# EAGLE schematic SmoothieBrainz - next round (EAGLE 8.4.3)
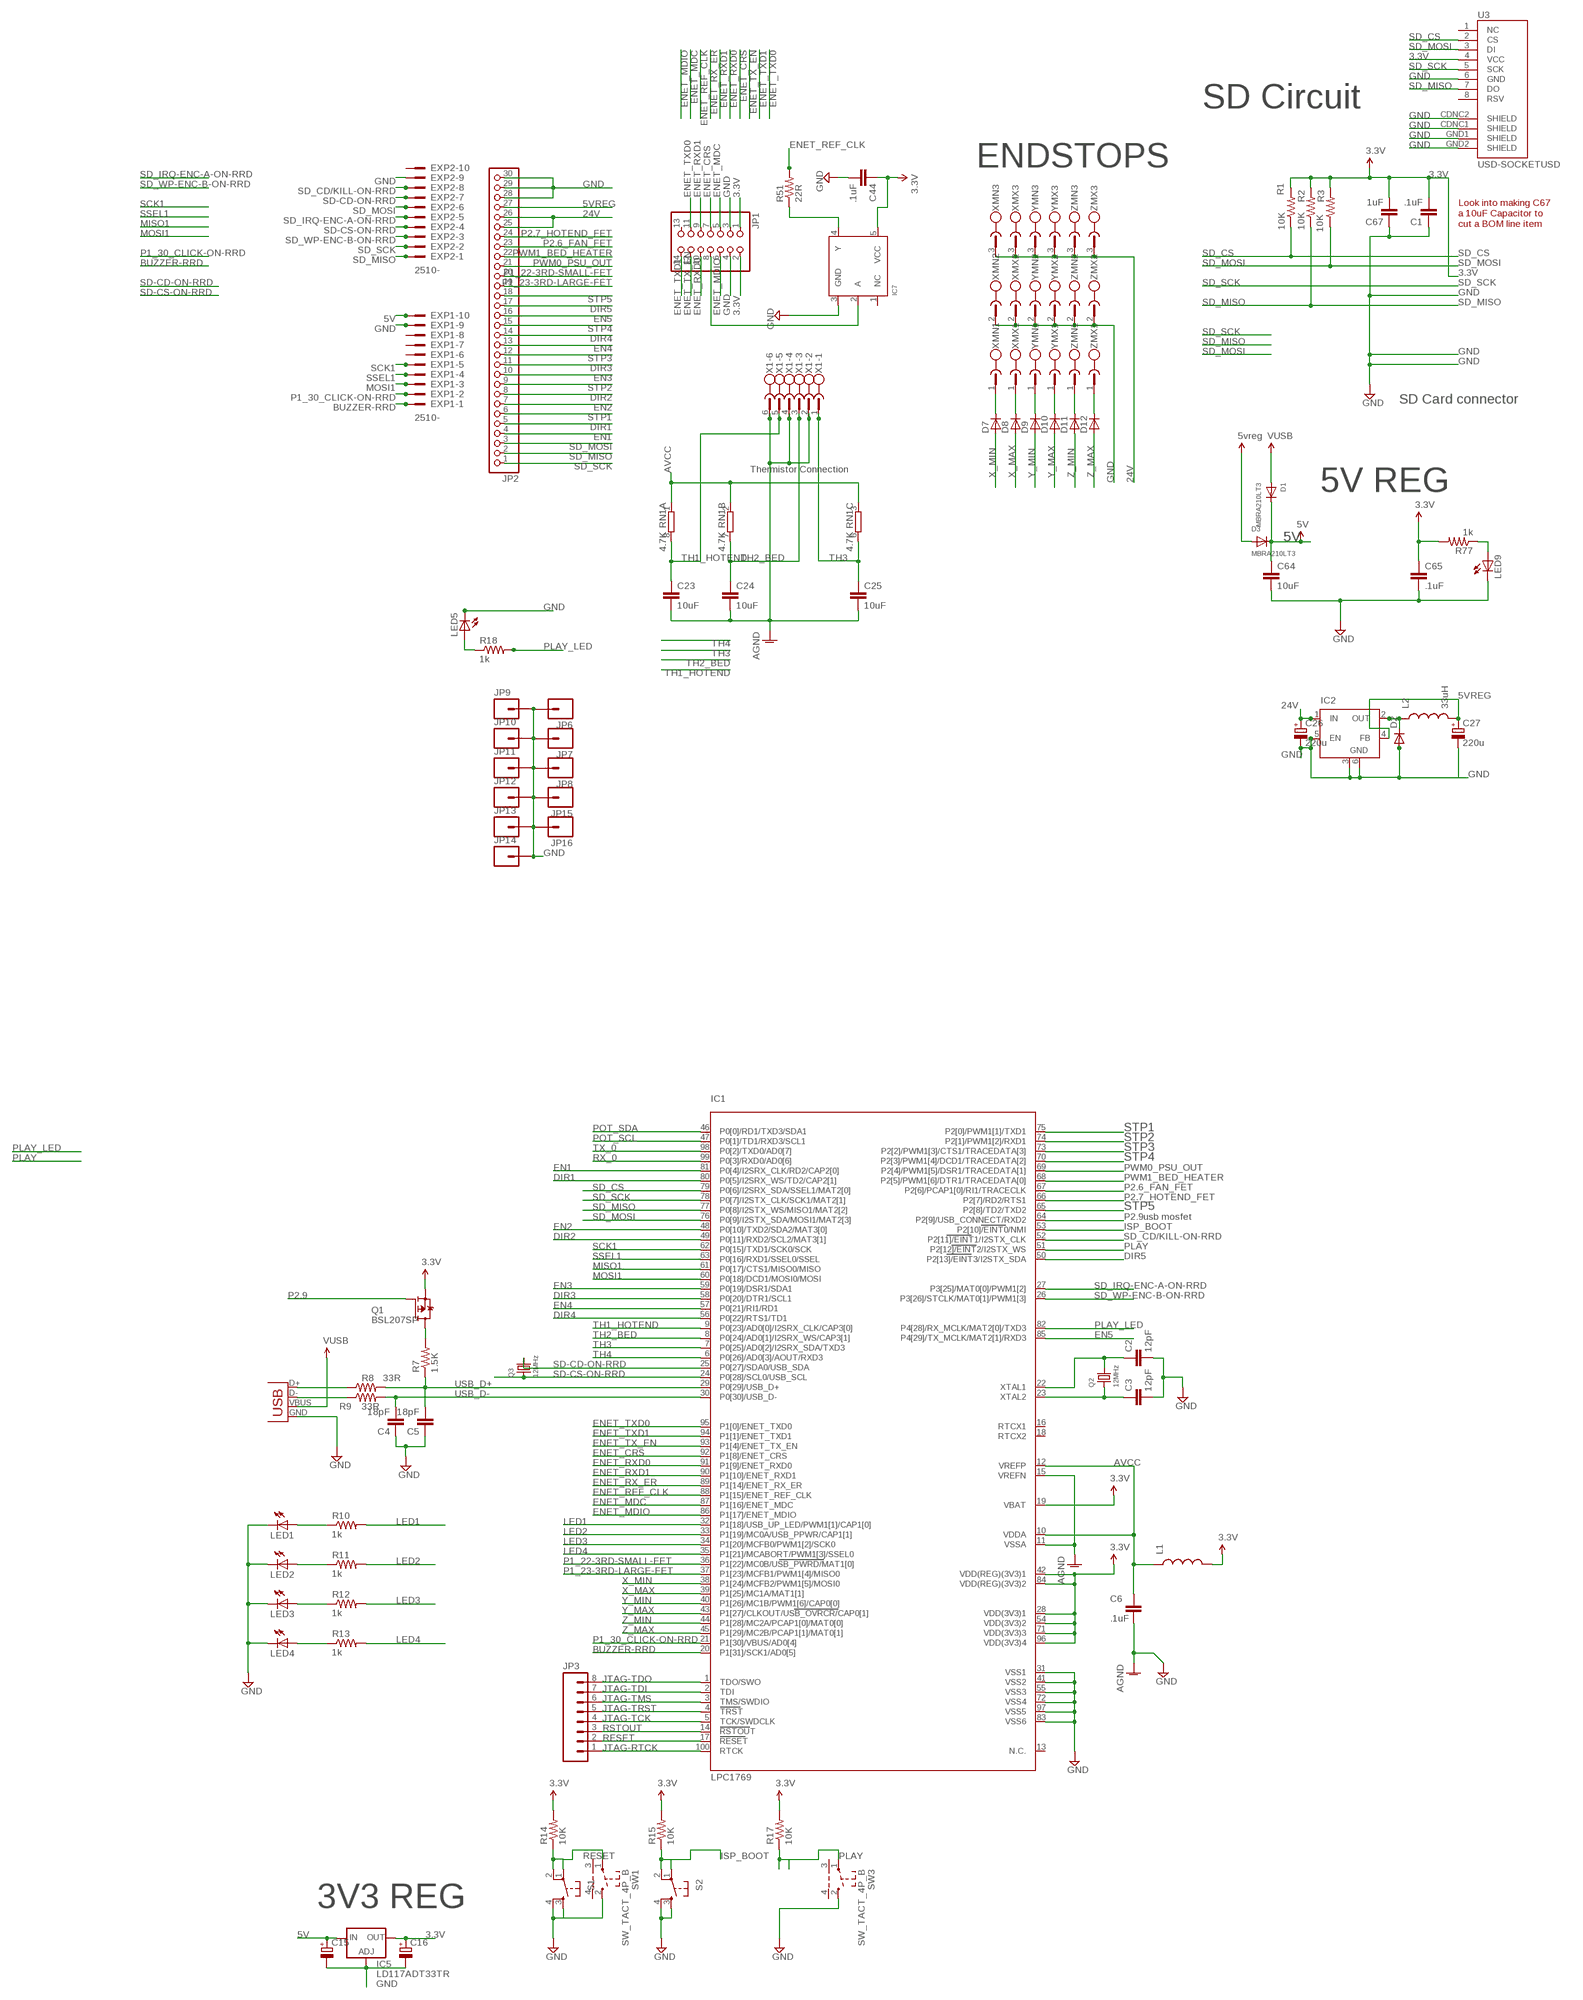
[diagram p0: schematic, sheet 1, part 1 of 2]
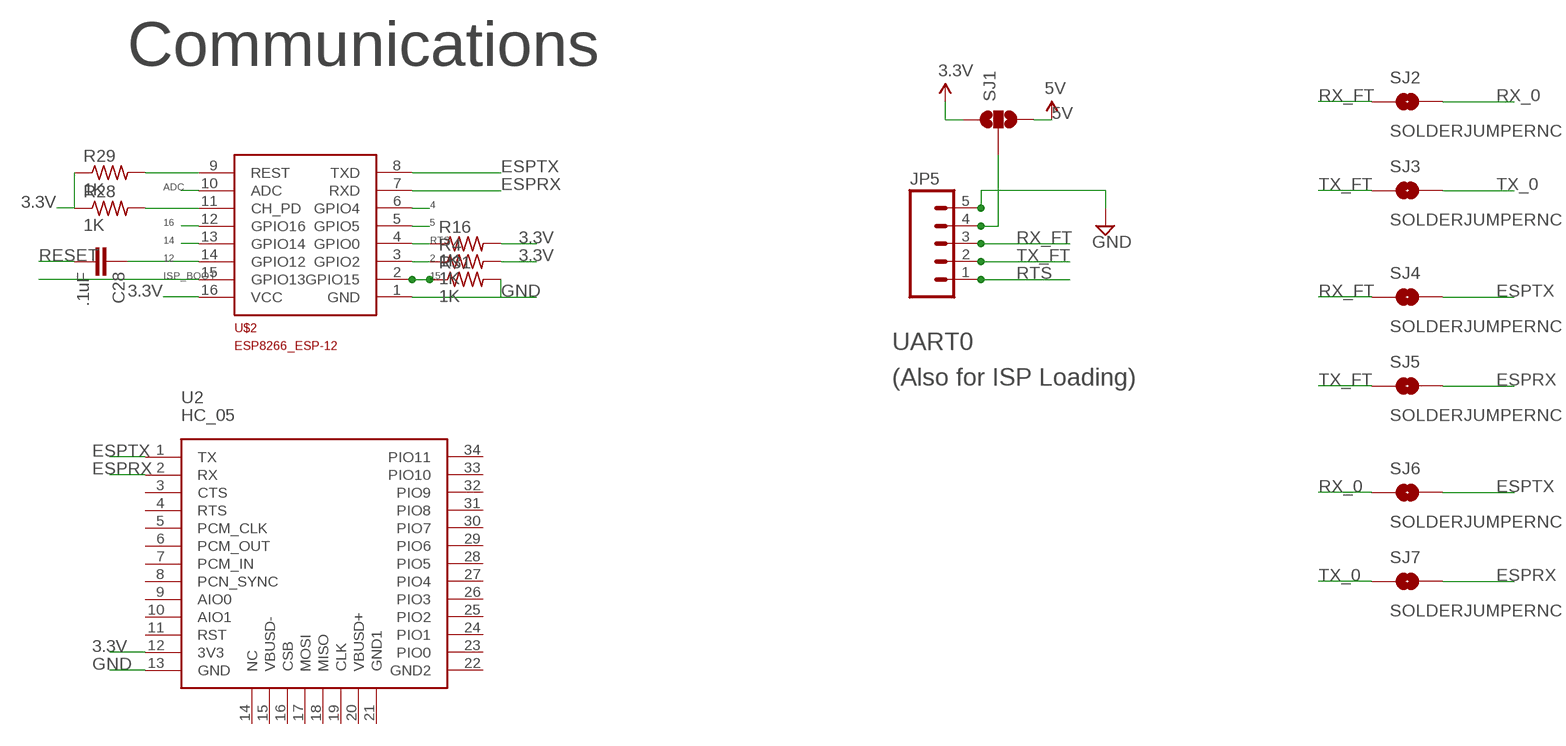
[diagram p1: schematic, sheet 1, part 2 of 2]

## Parts
C1  .1uF  C-EUC0603  [C0603]
C2  12pF  C-EUC0603  [C0603@1]
C3  12pF  C-EUC0603  [C0603@1]
C4  18pF  C-EUC0603  [C0603@1]
C5  18pF  C-EUC0603  [C0603@1]
C6  .1uF  C-EUC0603  [C0603@1]
C15  CPOL-EUE2.5-7  [E2,5-7]
C16  CPOL-EUE2.5-7  [E2,5-7]
C23  10uF  C-EUC0603  [C0603]
C24  10uF  C-EUC0603  [C0603]
C25  10uF  C-EUC0603  [C0603]
C26  220u  CPOL-EUE2.5-7  [E2,5-7]
C27  220u  CPOL-EUE2.5-7  [E2,5-7]
C28  .1uF  C-EUC0603  [C0603]
C44  .1uF  C-EUC0603  [C0603]
C64  10uF  C-EUC0603  [C0603]
C65  .1uF  C-EUC0603  [C0603]
C67  1uF  C-EUC0603  [C0603]
D1  MBRA210LT3  DIODESMA  [SMADIODE]
D2  DIODE-DO-214AC  [DO-214AC]
D3  MBRA210LT3  DIODESMA  [SMADIODE]
D7  D-SOD-87  [SOD87]
D8  D-SOD-87  [SOD87]
D9  D-SOD-87  [SOD87]
D10  D-SOD-87  [SOD87]
D11  D-SOD-87  [SOD87]
D12  D-SOD-87  [SOD87]
EXP1  2510-  [PAK100/2500-10]
EXP2  2510-  [PAK100/2500-10]
IC1  LPC1769  LPC1768  [LQFP100]
IC2  LM2596S  [TO263-5]
IC5  LD117ADT33TR  [DPACK]
IC7  74LVC1G04  [SOT23-5]
JP1  PINHD-2X7/90  [2X07/90]
JP2  PINHD-1X30  [1X30]
JP3  M08NO_SILK_FEMALE_PTH  [1X08_NO_SILK]
JP5  M05NO_SILK  [1X05_NO_SILK]
JP6  M01NOSILK-KIT  [1X01NS-KIT]
JP7  M01NOSILK-KIT  [1X01NS-KIT]
JP8  M01NOSILK-KIT  [1X01NS-KIT]
JP9  M01NOSILK-KIT  [1X01NS-KIT]
JP10  M01NOSILK-KIT  [1X01NS-KIT]
JP11  M01NOSILK-KIT  [1X01NS-KIT]
JP12  M01NOSILK-KIT  [1X01NS-KIT]
JP13  M01NOSILK-KIT  [1X01NS-KIT]
JP14  M01NOSILK-KIT  [1X01NS-KIT]
JP15  M01NOSILK-KIT  [1X01NS-KIT]
JP16  M01NOSILK-KIT  [1X01NS-KIT]
L1  INDUCTOR0603  [0603]
L2  33uH  INDUCTORPWR  [CDRH125]
LED1  LEDCHIP-LED0805  [CHIP-LED0805]
LED2  LEDCHIP-LED0805  [CHIP-LED0805]
LED3  LEDCHIP-LED0805  [CHIP-LED0805]
LED4  LEDCHIP-LED0805  [CHIP-LED0805]
LED5  LEDCHIP-LED0805  [CHIP-LED0805]
LED9  LEDCHIP-LED0805  [CHIP-LED0805]
Q1  BSL207SP  [SC74_INFINEON]
Q2  12MHz  CRYSTALTHIN  [CRYSTAL_3.2X2.5]
Q3  12MHz  CRYSTALTHIN  [CRYSTAL_3.2X2.5]
R1  10K  R-US_R0603  [R0603]
R2  10K  R-US_R0603  [R0603]
R3  10K  R-US_R0603  [R0603]
R4  1K  R-US_R0603  [R0603]
R7  1.5K  R-US_R0603  [R0603]
R8  33R  R-US_R0603  [R0603]
R9  33R  R-US_R0603  [R0603]
R10  1k  R-US_R0603  [R0603]
R11  1k  R-US_R0603  [R0603]
R12  1k  R-US_R0603  [R0603]
R13  1k  R-US_R0603  [R0603]
R14  10K  R-US_R0603  [R0603]
R15  10K  R-US_R0603  [R0603]
R16  1K  R-US_R0603  [R0603]
R17  10K  R-US_R0603  [R0603]
R18  1k  R-US_R0603  [R0603]
R28  1K  R-US_R0603  [R0603]
R29  1K  R-US_R0603  [R0603]
R31  1K  R-US_R0603  [R0603]
R51  22R  R-US_R0603  [R0603]
R77  1k  R-US_R0603  [R0603]
RN1  4.7K  4R-N0603-ARV  [0603-ARV]
S1  TAC_SWITCHSMD  [TACTILE_SWITCH_SMD]
S2  TAC_SWITCHSMD  [TACTILE_SWITCH_SMD]
SJ1  SOLDERJUMPER_2WAYS  [SJ_3]
SJ2  SOLDERJUMPERNC  [SJ_2S]
SJ3  SOLDERJUMPERNC  [SJ_2S]
SJ4  SOLDERJUMPERNC  [SJ_2S]
SJ5  SOLDERJUMPERNC  [SJ_2S]
SJ6  SOLDERJUMPERNC  [SJ_2S]
SJ7  SOLDERJUMPERNC  [SJ_2S]
SW1  SW_TACT_4P_B  [SW_TACT_STANDARD_RIGHT_ANGLE]
SW3  SW_TACT_4P_B  [SW_TACT_STANDARD_RIGHT_ANGLE]
U2  HC_05  [BLUETOOTH_SMD]
U3  USD-SOCKETUSD  [USD-SOCKET-PP]
U$2  ESP8266_ESP-12  [ESP8266-ESP12]
X1  MC1.5/6  [MC1.5/6-G-3.81]
X14  USBPTH  [USB-B-PTH]
XMN  MC1.5/3  [MC1.5/3-G-3.81]
XMX  MC1.5/3  [MC1.5/3-G-3.81]
YMN  MC1.5/3  [MC1.5/3-G-3.81]
YMX  MC1.5/3  [MC1.5/3-G-3.81]
ZMN  MC1.5/3  [MC1.5/3-G-3.81]
ZMX  MC1.5/3  [MC1.5/3-G-3.81]

## Nets
2: R4.1 U$2.3(GPIO2)
3.3V: C1.2 C16.+ C44.1 C65.1 C67.2 IC1.19(VBAT) IC1.28(VDD(3V3)1) IC1.42(VDD(REG)(3V3)1) IC1.54(VDD(3V3)2) IC1.71(VDD(3V3)3) IC1.84(VDD(REG)(3V3)2) IC1.96(VDD(3V3)4) IC5.4(OUT) IC7.5(VCC) JP1.1 JP1.2 L1.2 Q1.4(S) R1.2 R2.2 R3.2 R4.2 R14.2 R15.2 R16.2 R17.2 R28.1 R29.1 R77.2 SJ1.1 U2.12(3V3) U3.4(VCC) U$2.16(VCC)
4: U$2.6(GPIO4)
5: U$2.5(GPIO5)
5V: C15.+ C64.1 D1.C D3.C EXP1.10 IC5.3(IN) SJ1.3
5VREG: C27.+ D3.A IC2.4(FB) JP2.27 L2.2 ; supply symbol labelled 5vreg
12: C28.1 U$2.14(GPIO12)
14: U$2.13(GPIO14)
15: R31.1 U$2.2(GPIO15)
16: U$2.12(GPIO16)
24V: C26.+ IC2.1(IN) JP2.25 JP2.26 XMN.3 XMX.3 YMN.3 YMX.3 ZMN.3 ZMX.3
ADC: U$2.10(ADC)
AGND: C6.2 C23.2 C24.2 C25.2 IC1.11(VSSA) IC1.15(VREFN) X1.2 X1.4 X1.6 ; supply symbol labelled GND
AVCC: C6.1 IC1.10(VDDA) IC1.12(VREFP) L1.1 RN1.1 RN1.2 RN1.3
BUZZER-RRD: EXP1.1 IC1.20(P1[31]/SCK1/AD0[5])
DIR1: IC1.80(P0[5]/I2SRX_WS/TD2/CAP2[1]) JP2.5
DIR2: IC1.49(P0[11]/RXD2/SCL2/MAT3[1]) JP2.8
DIR3: IC1.58(P0[20]/DTR1/SCL1) JP2.11
DIR4: IC1.56(P0[22]/RTS1/TD1) JP2.14
DIR5: IC1.50(P2[13]/EINT3/I2STX_SDA) JP2.17
EN1: IC1.81(P0[4]/I2SRX_CLK/RD2/CAP2[0]) JP2.4
EN2: IC1.48(P0[10]/TXD2/SDA2/MAT3[0]) JP2.7
EN3: IC1.59(P0[19]/DSR1/SDA1) JP2.10
EN4: IC1.57(P0[21]/RI1/RD1) JP2.13
EN5: IC1.85(P4[29]/TX_MCLK/MAT2[1]/RXD3) JP2.16
ENET_CRS: IC1.92(P1[8]/ENET_CRS) JP1.7
ENET_MDC: IC1.87(P1[16]/ENET_MDC) JP1.5
ENET_MDIO: IC1.86(P1[17]/ENET_MDIO) JP1.6
ENET_REF_CLK: IC1.88(P1[15]/ENET_REF_CLK) R51.2
ENET_RX_ER: IC1.89(P1[14]/ENET_RX_ER)
ENET_RXD0: IC1.91(P1[9]/ENET_RXD0) JP1.10
ENET_RXD1: IC1.90(P1[10]/ENET_RXD1) JP1.9
ENET_TX_EN: IC1.93(P1[4]/ENET_TX_EN) JP1.12
ENET_TXD0: IC1.95(P1[0]/ENET_TXD0) JP1.11
ENET_TXD1: IC1.94(P1[1]/ENET_TXD1) JP1.14
ESPRX: SJ5.2 SJ7.2 U2.2(RX) U$2.7(RXD)
ESPTX: SJ4.2 SJ6.2 U2.1(TX) U$2.8(TXD)
GND: C1.1 C2.2 C3.2 C4.1 C5.1 C15.- C16.- C26.- C27.- C44.2 C64.2 C65.2 C67.1 D2.2(A) EXP1.9 EXP2.9 IC1.31(VSS1) IC1.41(VSS2) IC1.55(VSS3) IC1.72(VSS4) IC1.83(VSS6) IC1.97(VSS5) IC2.3(GND) IC2.5(EN) IC2.6(GND) IC5.1(ADJ) IC7.3(GND) JP1.3 JP1.4 JP2.28 JP2.29 JP2.30 JP5.5 JP6.1 JP7.1 JP8.1 JP9.1 JP10.1 JP11.1 JP12.1 JP13.1 JP14.1 JP15.1 JP16.1 LED1.C LED2.C LED3.C LED4.C LED5.C LED9.C R31.2 S1.3 S1.4 S2.3 S2.4 SW1.2 SW3.2 U2.13(GND) U3.6(GND) U3.CDNC1(SHIELD) U3.CDNC2(SHIELD) U3.GND1(SHIELD) U3.GND2(SHIELD) U$2.1(GND) X14.GND XMN.2 XMX.2 YMN.2 YMX.2 ZMN.2 ZMX.2
ISP_BOOT: IC1.53(P2[10]/EINT0/NMI) R15.1 S2.1 S2.2 U$2.15(GPIO13)
JTAG-RTCK: IC1.100(RTCK) JP3.1
JTAG-TCK: IC1.5(TCK/SWDCLK) JP3.4
JTAG-TDI: IC1.2(TDI) JP3.7
JTAG-TDO: IC1.1(TDO/SWO) JP3.8
JTAG-TMS: IC1.3(TMS/SWDIO) JP3.6
JTAG-TRST: IC1.4(TRST) JP3.5
LED1: IC1.32(P1[18]/USB_UP_LED/PWM1[1]/CAP1[0]) R10.2
LED2: IC1.33(P1[19]/MC0A/USB_PPWR/CAP1[1]) R11.2
LED3: IC1.34(P1[20]/MCFB0/PWM1[2]/SCK0) R12.2
LED4: IC1.35(P1[21]/MCABORT/PWM1[3]/SSEL0) R13.2
MISO1: IC1.61(P0[17]/CTS1/MISO0/MISO)
MOSI1: EXP1.3 IC1.60(P0[18]/DCD1/MOSI0/MOSI)
N$1: C2.1 IC1.22(XTAL1) Q2.2
N$2: C3.1 IC1.23(XTAL2) Q2.1
N$3: LED5.A R18.1
N$6: D7.1(C) XMN.1
N$8: D8.1(C) XMX.1
N$9: D2.1(C) IC2.2(OUT) L2.1
N$10: D9.1(C) YMN.1
N$12: D10.1(C) YMX.1
N$15: D11.1(C) ZMN.1
N$16: D12.1(C) ZMX.1
N$18: R28.2 U$2.11(CH_PD)
N$23: JP5.4 SJ1.2
N$51: Q1.1(D) Q1.2(D) Q1.5(D) Q1.6(D) R7.2
N$61: R8.1 X14.D+
N$62: R9.1 X14.D-
N$77: IC7.2(A) JP1.8
N$78: IC7.4(Y) R51.1
N$80: LED9.A R77.1
N$84: LED4.A R13.1
N$85: LED3.A R12.1
N$86: LED2.A R11.1
N$87: LED1.A R10.1
P1_22-3RD-SMALL-FET: IC1.36(P1[22]/MC0B/USB_PWRD/MAT1[0]) JP2.20
P1_23-3RD-LARGE-FET: IC1.37(P1[23]/MCFB1/PWM1[4]/MISO0) JP2.19
P1_30_CLICK-ON-RRD: EXP1.2 IC1.21(P1[30]/VBUS/AD0[4])
P2.6_FAN_FET: IC1.67(P2[6]/PCAP1[0]/RI1/TRACECLK) JP2.23
P2.7_HOTEND_FET: IC1.66(P2[7]/RD2/RTS1) JP2.24
P2.9: IC1.64(P2[9]/USB_CONNECT/RXD2) Q1.3(G)
PLAY: IC1.51(P2[12]/EINT2/I2STX_WS) R17.1 SW3.1
PLAY_LED: IC1.82(P4[28]/RX_MCLK/MAT2[0]/TXD3) R18.2
POT_SCL: IC1.47(P0[1]/TD1/RXD3/SCL1)
POT_SDA: IC1.46(P0[0]/RD1/TXD3/SDA1)
PWM0_PSU_OUT: IC1.69(P2[4]/PWM1[5]/DSR1/TRACEDATA[1]) JP2.21
PWM1_BED_HEATER: IC1.68(P2[5]/PWM1[6]/DTR1/TRACEDATA[0]) JP2.22
RESET: C28.2 IC1.17(RESET) JP3.2 R14.1 S1.1 S1.2 SW1.1
RESET1: R29.2 U$2.9(REST)
RSTOUT: IC1.14(RSTOUT) JP3.3
RTS: JP5.1 R16.1 U$2.4(GPIO0)
RX_0: IC1.99(P0[3]/RXD0/AD0[6]) SJ2.2 SJ6.1
RX_FT: JP5.3 SJ2.1 SJ4.1
SCK1: EXP1.5 IC1.62(P0[15]/TXD1/SCK0/SCK)
SD-CD-ON-RRD: EXP2.7 IC1.25(P0[27]/SDA0/USB_SDA) Q3.2
SD-CS-ON-RRD: EXP2.4 IC1.24(P0[28]/SCL0/USB_SCL) Q3.1
SD_CD/KILL-ON-RRD: EXP2.8 IC1.52(P2[11]/EINT1/I2STX_CLK)
SD_CS: IC1.79(P0[6]/I2SRX_SDA/SSEL1/MAT2[0]) R1.1 U3.2(CS)
SD_IRQ-ENC-A-ON-RRD: EXP2.5 IC1.27(P3[25]/MAT0[0]/PWM1[2])
SD_MISO: EXP2.1 IC1.77(P0[8]/I2STX_WS/MISO1/MAT2[2]) JP2.2 R2.1 U3.7(DO)
SD_MOSI: EXP2.6 IC1.76(P0[9]/I2STX_SDA/MOSI1/MAT2[3]) JP2.3 R3.1 U3.3(DI)
SD_SCK: EXP2.2 IC1.78(P0[7]/I2STX_CLK/SCK1/MAT2[1]) JP2.1 U3.5(SCK)
SD_WP-ENC-B-ON-RRD: EXP2.3 IC1.26(P3[26]/STCLK/MAT0[1]/PWM1[3])
SSEL1: EXP1.4 IC1.63(P0[16]/RXD1/SSEL0/SSEL)
STP1: IC1.75(P2[0]/PWM1[1]/TXD1) JP2.6
STP2: IC1.74(P2[1]/PWM1[2]/RXD1) JP2.9
STP3: IC1.73(P2[2]/PWM1[3]/CTS1/TRACEDATA[3]) JP2.12
STP4: IC1.70(P2[3]/PWM1[4]/DCD1/TRACEDATA[2]) JP2.15
STP5: IC1.65(P2[8]/TD2/TXD2) JP2.18
TH1_HOTEND: C23.1 IC1.9(P0[23]/AD0[0]/I2SRX_CLK/CAP3[0]) RN1.8 X1.5
TH2_BED: C24.1 IC1.8(P0[24]/AD0[1]/I2SRX_WS/CAP3[1]) RN1.7 X1.3
TH3: C25.1 IC1.7(P0[25]/AD0[2]/I2SRX_SDA/TXD3) RN1.6 X1.1
TH4: IC1.6(P0[26]/AD0[3]/AOUT/RXD3)
TX_0: IC1.98(P0[2]/TXD0/AD0[7]) SJ3.2 SJ7.1
TX_FT: JP5.2 SJ3.1 SJ5.1
USB_D+: C5.2 IC1.29(P0[29]/USB_D+) R7.1 R8.2
USB_D-: C4.2 IC1.30(P0[30]/USB_D-) R9.2
VUSB: D1.A X14.VBUS
X_MAX: D8.2(A) IC1.39(P1[25]/MC1A/MAT1[1])
X_MIN: D7.2(A) IC1.38(P1[24]/MCFB2/PWM1[5]/MOSI0)
Y_MAX: D10.2(A) IC1.43(P1[27]/CLKOUT/USB_OVRCR/CAP0[1])
Y_MIN: D9.2(A) IC1.40(P1[26]/MC1B/PWM1[6]/CAP0[0])
Z_MAX: D12.2(A) IC1.45(P1[29]/MC2B/PCAP1[1]/MAT0[1])
Z_MIN: D11.2(A) IC1.44(P1[28]/MC2A/PCAP1[0]/MAT0[0])
Unconnected: EXP1.6 EXP1.7 EXP1.8 EXP2.10 IC1.13(N.C.) IC1.16(RTCX1) IC1.18(RTCX2) IC7.1(NC) JP1.13 RN1.4 RN1.5 SW1.3 SW1.4 SW3.3 SW3.4 U2.3(CTS) U2.4(RTS) U2.5(PCM_CLK) U2.6(PCM_OUT) U2.7(PCM_IN) U2.8(PCN_SYNC) U2.9(AIO0) U2.10(AIO1) U2.11(RST) U2.14(NC) U2.15(VBUSD-) U2.16(CSB) U2.17(MOSI) U2.18(MISO) U2.19(CLK) U2.20(VBUSD+) U2.21(GND1) U2.22(GND2) U2.23(PIO0) U2.24(PIO1) U2.25(PIO2) U2.26(PIO3) U2.27(PIO4) U2.28(PIO5) U2.29(PIO6) U2.30(PIO7) U2.31(PIO8) U2.32(PIO9) U2.33(PIO10) U2.34(PIO11) U3.1(NC) U3.8(RSV)

## Notes on the sheet
- SD Circuit | Communications
- ENDSTOPS
- Look into making C67 
  a 10uF Capacitor to 
  cut a BOM line item
- UART0
- (Also for ISP Loading)
- SD Card connector
- Thermistor Connection
- 5V REG
- usb mosfet
- 3V3 REG

## Library data of the parts
C1 C23-C25 C28 C44 C64 C65 C67 = resistor:C-EU: CAPACITOR, European symbol
C2-C6 = rcl:C-EU: CAPACITOR, European symbol
C15 C16 C26 C27 = rcl:CPOL-EU: POLARIZED CAPACITOR, European symbol
D1 D3 = microbuilder:DIODE: Diode SMADIODE - SMA Surface Mount Package 20V 1A Schottky Diode Digikey (500mV @ 1A, 500uA Vr @ 20V): 641-1014-6-ND 10V 2A Schottky Diode Digikey (350mV @ 2A, 700uA Vr @ 10V): MBRA210LT3 SOD-123 30V 200mA (800mV Vf, 2uA Vr @ 25V) Schottky Diode (very fast switching for boost, etc.) - Digikey: BAT54T1GOSTR-ND 30V 500mA (430mV Vf, 130uA Vr @ 30V) Schottky Diode - Digikey: B0530W-FDICT-ND MBR120 1A 20V (0.34Vf) Schottky Diode - Digikey: MBR120VLSFT1GOSCT-ND SOD-323 10V 570mA (380mV Vf, 3ns) Schottky Diode - Digikey: ZLLS410CT-ND 1N4148WS - 75V 150mA (1V Vf @ 10mA, 4ns) Simple Diode - Digikey: 1N4148WSFSCT-ND, Mouser: 512-1N4148WS SOD-523 BAT54 30V 200mA Schottky (0.8 Vf @ 100mA, 5ns) - Digikey: BAT54XV2CT-ND 30V 30mA Schottky Diode (RB751S-40TE61) - Digikey: RB751S-40TE61CT-ND SOT23-R/W - SOT23 Package (R = Solder Paste/Reflow Ovens, W = Hand-Soldering) BAT54Film 40V 300mA - Digikey: 497-7162-1-ND DO-1N4148 Through Hole Small Current Diode (any model)
D2 = dp_devices:DIODE: Various Diode Packages
D7-D12 = semicon-smd-ipc:D-: DIODE unfilled
EXP1 EXP2 = con-3m:2510-: 3M (TM) Pak 100 4-Wall Header Source: 3M; MF: 3M; MPN: 2510-6002UB; OC_FARNELL: 9838244; OC_NEWARK: 46F4725
IC1 = microbuilder:LPC1768: LPC1768 100 MHz 32-bit ARM Cortex-M3 based microcontroller featuring a high level of integration and low power consumption. 512 kB Flash, 64 kB SRAM, USB Device/Host/OTG, Ethernet, CAN, I2S, 10-bit DAC Digikey: 568-4796-ND
IC2 = linear:LM2596S: STEP-DOWN VOLTAGE REGULATOR
IC5 = v-reg:LD117A?*: Low drop fixed and adjustable positive voltage regulators 1 A Source: http://www.st.com/stonline/products/literature/ds/7194/ld1117axx.pdf
IC7 = microbuilder:74LVC1G04: 74LVC1G04 - Single Inverter Gate SOT23-5 SN74LVC1G04DBVR - Digikey: 296-11599-1-ND
JP1 = pinhead:PINHD-2X7: PIN HEADER
JP2 = pinhead:PINHD-1X30: PIN HEADER
JP3 = SparkFun-Connectors:M08: Header 8 Standard 8-pin 0.1" header. Use with straight break away headers (SKU : PRT-00116), right angle break away headers (PRT-00553), swiss pins (PRT-00743), machine pins (PRT-00117), and female headers (PRT-00115).; PROD_ID: CONN-08438
JP5 = SparkFun-Connectors:M05: Header 5 Standard 5-pin 0.1" header. Use with straight break away headers (SKU : PRT-00116), right angle break away headers (PRT-00553), swiss pins (PRT-00743), machine pins (PRT-00117), and female headers (PRT-00115). Molex polarized connector foot print use with SKU : PRT-08230 with associated crimp pins and housings.
JP6-JP16 = SparkFun-Connectors:M01: Header 1 Standard 1-pin 0.1" header. Use with straight break away headers (SKU : PRT-00116), right angle break away headers (PRT-00553), swiss pins (PRT-00743), machine pins (PRT-00117), and female headers (PRT-00115). SMTSO-256-ET is a "flush mount" nut for a 4-40 screw. The older package used to be too tight, and did not allow it to sit properly thru the drill hit. The latest (0.165DIA) fits nice and snug.
L1 = SparkFun:INDUCTOR: Inductors
L2 = SparkFun-Passives:INDUCTOR: Inductors
LED1-LED5 LED9 = led:LED: LED OSRAM: - CHIPLED LG R971, LG N971, LY N971, LG Q971, LY Q971, LO R971, LY R971 LH N974, LH R974 LS Q976, LO Q976, LY Q976 LO Q996 - Hyper CHIPLED LW Q18S LB Q993, LB Q99A, LB R99A - SideLED LS A670, LO A670, LY A670, LG A670, LP A670 LB A673, LV A673, LT A673, LW A673 LH A674 LY A675 LS A676, LA A676, LO A676, LY A676, LW A676 LS A679, LY A679, LG A679 - Hyper Micro SIDELED® LS Y876, LA Y876, LO Y876, LY Y876 LT Y87S - SmartLED LW L88C, LW L88S LB L89C, LB L89S, LG L890 LS L89K, LO L89K, LY L89K LS L896, LA L896, LO L896, LY L896 - TOPLED LS T670, LO T670, LY T670, LG T670, LP T670 LSG T670, LSP T670, LSY T670, LOP T670, LYG T670 LG T671, LOG T671, LSG T671 LB T673, LV T673, LT T673, LW T673 LH T674 LS T676, LA T676, LO T676, LY T676, LB T676, LH T676, LSB T676, LW T676 LB T67C, LV T67C, LT T67C, LS T67K, LO T67K, LY T67K, LW E67C LS E67B, LA E67B, LO E67B, LY E67B, LB E67C, LV E67C, LT E67C LW T67C LS T679, LY T679, LG T679 LS T770, LO T770, LY T770, LG T770, LP T770 LB T773, LV T773, LT T773, LW T773 LH T774 LS E675, LA E675, LY E675, LS T675 LS T776, LA T776, LO T776, LY T776, LB T776 LHGB T686 LT T68C, LB T68C - Hyper Mini TOPLED® LB M676 - Mini TOPLED Santana® LG M470 LS M47K, LO M47K, LY M47K Source: http://www.osram.convergy.de LUXEON: - LUMILED® LXK2-PW12-R00, LXK2-PW12-S00, LXK2-PW14-U00, LXK2-PW14-V00 LXK2-PM12-R00, LXK2-PM12-S00, LXK2-PM14-U00 LXK2-PE12-Q00, LXK2-PE12-R00, LXK2-PE12-S00, LXK2-PE14-T00, LXK2-PE14-U00 LXK2-PB12-K00, LXK2-PB12-L00, LXK2-PB12-M00, LXK2-PB14-N00, LXK2-PB14-P00, LXK2-PB14-Q00 LXK2-PR12-L00, LXK2-PR12-M00, LXK2-PR14-Q00, LXK2-PR14-R00 LXK2-PD12-Q00, LXK2-PD12-R00, LXK2-PD12-S00 LXK2-PH12-R00, LXK2-PH12-S00 LXK2-PL12-P00, LXK2-PL12-Q00, LXK2-PL12-R00 Source: www.luxeon.com KINGBRIGHT: KA-3528ASYC Source: www.kingbright.com
Q1 = transistor-fet:BSL207SP: OptiMOS(R)-P Small-Signal-Transistor P-Channel, Enhancement mode, Super Logic Level (2.5 V rated) Source: http://www.infineon.com/upload/Document/BSL207SP_Rev2.01.pdf
Q2 Q3 = microbuilder:CRYSTAL: Crystals HC49UP - Surface Mount Crystal 4.0MHz 18pF +/-30ppm Surface Mount Crystal [Digikey: 535-9857-1-ND] 12.0 MHz Surface Mount Crystal [Digikey: 535-9869-6-ND] 25.0 MHz Surface Mount Crystal [Digikey: 535-9078-1-ND] 3.2 x 2.5mm - MEMs SMT Crystal 12.0 MHz 8pF 15ppm 3.2 x 2.5mm Crystal [Digikey: -10-70°C: 644-1047-1-ND -40-125°C: 644-1128-1-ND] 16.0 MHz 8pF 15ppm 3.2 x 2.5mm Crystal [Digikey: -10-70°C: 644-1049-1-ND -40-125°C: 644-1129-2-ND] 16.0 MHz 10pF 10ppm 3.2 x 2.5mm Crystal [Digikey: 644-1100-1-ND] 27.12 MHz 18pF 30ppm 3.2 x 2.5mm Crystal [Digikey: 887-1424-1-ND] 27.12MHz 10pF 10ppm 3.2 x 2.5mm Crystal [Digikey: 887-1329-1-ND] 4.9 x 1.8mm - MEMs SMT Crystal 32.768 KHz 12.5pF 20ppm 4.9 x 1.8mm Crystal [Digikey: SE2415CT-ND] Cylinder 32.768KHz Cylinder Crystal
R1-R3 R7-R15 R17 R18 R51 R77 = resistor:R-US_: RESISTOR, American symbol
R4 R16 R28 R29 R31 = adafruit:R-US_: RESISTOR, American symbol
RN1 = resistor-dil:4R-N: Array Chip Resistor Source: RS Component / Phycomp; OC_FARNELL: unknown; OC_NEWARK: unknown
S1 S2 = SparkFun:TAC_SWITCH: Momentary Switch Button commonly used for reset or general input. Spark Fun Electronics SKU : COM-00097
SJ1 = SparkFun:SOLDERJUMPER_2WAY: Solder Jumper 2 way solder jumper
SJ2-SJ7 = SparkFun-Retired:SOLDERJUMPER: Solder Jumper Standard SMD solder jumper. Used to automate production. Two varients : Normally Open and Normally Closed are the same, but have different paste layers. NC will have a large amount of paste and should jumper during reflow.
SW1 SW3 = dp_devices:SW_TACT_4P_B
U2 = SerialPortBluetooth:HC_05
U3 = SparkFun-Connectors_PETERMICROSDEBAY:USD-SOCKET: microSD Socket Push-push type uSD socket. Schematic element and footprint production proven. Spark Fun Electronics SKU : PRT-00127. tDoc lines correctly indicate media card edge positions when inserting (unlocked, locked, depressed).
U$2 = ESP8266-ESP12:ESP8266_ESP-12: ESP8266 ESP-12 Discussion about pins here: http://www.esp8266.com/viewtopic.php?f=13&t=1429
X1 = jt-con-phoenix-3.81:MC1.5/6: PHOENIX
X14 = SparkFun:USB: USB Connectors USB-B-PTH is fully proven SKU : PRT-00139 USB-miniB is fully proven SKU : PRT-00587 USB-A-PCB is untested. USB-A-H is throughly reviewed, but untested. Spark Fun Electronics SKU : PRT-00437 USB-B-SMT is throughly reviewed, but untested. Needs silkscreen touching up. USB-A-S has not been used/tested USB-MB-H has not been used/tested
XMN XMX YMN YMX ZMN ZMX = jt-con-phoenix-3.81:MC1.5/3: PHOENIX

## Net classes
1 power: width 0.6 mm, clearance 0.305 mm